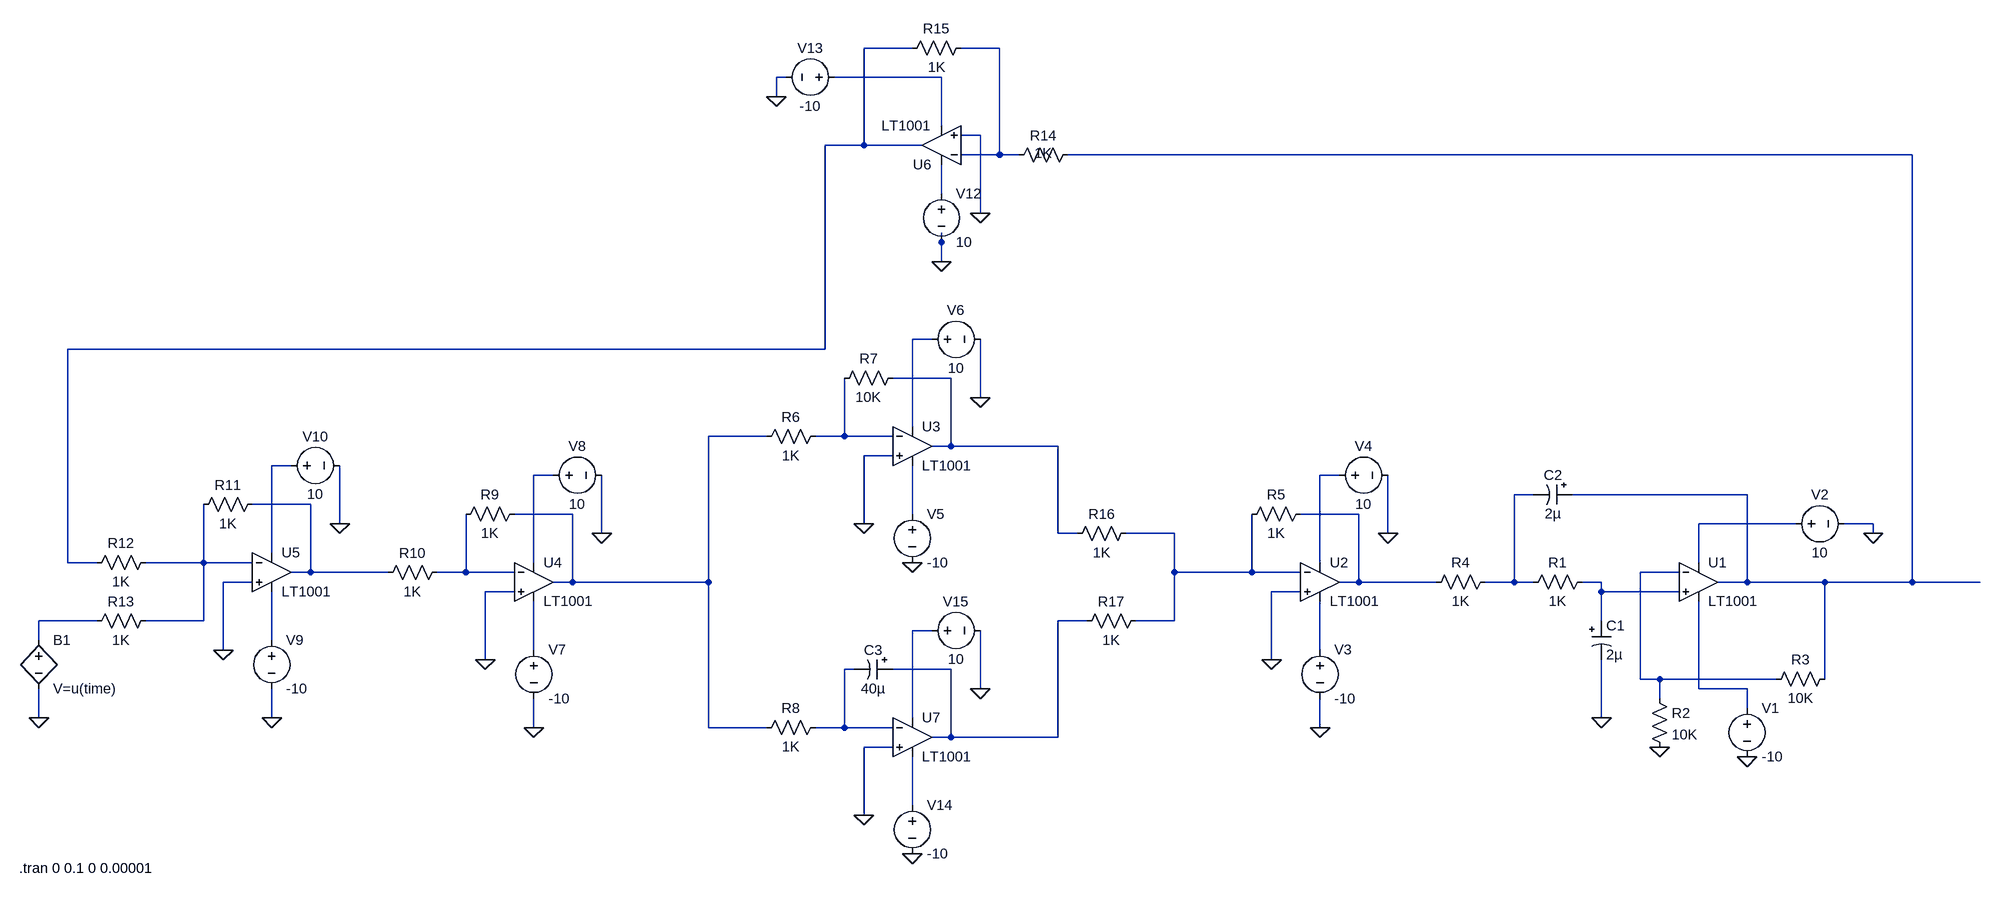
[diagram p0: schematic PI_controller.asc]
PI_controller.asc, the LTspice schematic file:
Version 4
SHEET 1 2324 1300
WIRE 560 -112 480 -112
WIRE 704 -112 640 -112
WIRE 352 -64 336 -64
WIRE 608 -64 432 -64
WIRE 336 -32 336 -64
WIRE 608 16 608 -64
WIRE 672 32 640 32
WIRE 480 48 480 -112
WIRE 480 48 416 48
WIRE 576 48 480 48
WIRE 704 64 704 -112
WIRE 704 64 640 64
WIRE 736 64 704 64
WIRE 2208 64 816 64
WIRE 608 128 608 80
WIRE 672 160 672 32
WIRE 608 208 608 192
WIRE 608 240 608 208
WIRE 592 368 560 368
WIRE 416 384 416 48
WIRE 416 384 -832 384
WIRE 624 432 528 432
WIRE 672 464 672 368
WIRE 560 512 560 368
WIRE 320 528 224 528
WIRE 448 528 448 432
WIRE 448 528 400 528
WIRE 528 528 448 528
WIRE 624 544 624 432
WIRE 624 544 592 544
WIRE 800 544 624 544
WIRE 528 560 480 560
WIRE -464 576 -496 576
WIRE -32 592 -64 592
WIRE 1264 592 1232 592
WIRE 1584 624 1552 624
WIRE 1936 624 1648 624
WIRE -432 640 -528 640
WIRE 0 656 -96 656
WIRE 560 656 560 576
WIRE 1296 656 1200 656
WIRE -384 672 -384 576
WIRE 480 672 480 560
WIRE 2016 672 1856 672
WIRE 2144 672 2096 672
WIRE 48 688 48 592
WIRE 800 688 800 544
WIRE 832 688 800 688
WIRE 992 688 912 688
WIRE 1344 688 1344 592
WIRE 2144 688 2144 672
WIRE -496 720 -496 576
WIRE -832 736 -832 384
WIRE -784 736 -832 736
WIRE -608 736 -608 640
WIRE -608 736 -704 736
WIRE -528 736 -608 736
WIRE -64 736 -64 592
WIRE 1232 736 1232 592
WIRE 1856 736 1856 672
WIRE -432 752 -432 640
WIRE -432 752 -464 752
WIRE -304 752 -432 752
WIRE -176 752 -176 656
WIRE -176 752 -224 752
WIRE -96 752 -176 752
WIRE 992 752 992 688
WIRE 1120 752 1120 656
WIRE 1120 752 992 752
WIRE 1200 752 1120 752
WIRE 1824 752 1760 752
WIRE -528 768 -576 768
WIRE 0 768 0 656
WIRE 0 768 -32 768
WIRE 224 768 224 528
WIRE 224 768 0 768
WIRE 1296 768 1296 656
WIRE 1296 768 1264 768
WIRE 1424 768 1296 768
WIRE 1552 768 1552 624
WIRE 1552 768 1504 768
WIRE 1584 768 1552 768
WIRE 1696 768 1664 768
WIRE 1936 768 1936 624
WIRE 1936 768 1888 768
WIRE 2064 768 1936 768
WIRE 2208 768 2208 64
WIRE 2208 768 2064 768
WIRE 2320 768 2208 768
WIRE -96 784 -144 784
WIRE 1200 784 1152 784
WIRE 1696 784 1696 768
WIRE 1824 784 1696 784
WIRE -784 832 -880 832
WIRE -608 832 -608 736
WIRE -608 832 -704 832
WIRE 848 832 800 832
WIRE 992 832 992 752
WIRE 992 832 928 832
WIRE 1696 832 1696 784
WIRE 592 848 560 848
WIRE -880 864 -880 832
WIRE -496 864 -496 784
WIRE -576 880 -576 768
WIRE -64 880 -64 800
WIRE 1232 880 1232 800
WIRE -144 896 -144 784
WIRE 1152 896 1152 784
WIRE 464 912 448 912
WIRE 624 912 528 912
WIRE 1760 928 1760 752
WIRE 1792 928 1760 928
WIRE 1984 928 1792 928
WIRE 2064 928 2064 768
WIRE 672 944 672 848
WIRE 1856 944 1856 800
WIRE 1936 944 1856 944
WIRE 1792 960 1792 928
WIRE 1936 976 1936 944
WIRE -880 992 -880 944
WIRE -496 992 -496 944
WIRE 560 992 560 848
WIRE 1696 992 1696 896
WIRE -64 1008 -64 960
WIRE 224 1008 224 768
WIRE 320 1008 224 1008
WIRE 448 1008 448 912
WIRE 448 1008 400 1008
WIRE 528 1008 448 1008
WIRE 1232 1008 1232 960
WIRE 624 1024 624 912
WIRE 624 1024 592 1024
WIRE 800 1024 800 832
WIRE 800 1024 624 1024
WIRE 528 1040 480 1040
WIRE 560 1136 560 1056
WIRE 480 1152 480 1040
FLAG 1792 1040 0
FLAG 1696 992 0
FLAG 1936 1056 0
FLAG 2144 688 0
FLAG 1344 688 0
FLAG 1232 1008 0
FLAG 1152 896 0
FLAG 672 464 0
FLAG 560 736 0
FLAG 480 672 0
FLAG 48 688 0
FLAG -64 1008 0
FLAG -144 896 0
FLAG -384 672 0
FLAG -496 992 0
FLAG -576 880 0
FLAG -880 992 0
FLAG 608 240 0
FLAG 336 -32 0
FLAG 672 944 0
FLAG 560 1216 0
FLAG 480 1152 0
FLAG 672 160 0
SYMBOL voltage 1936 960 R0
WINDOW 123 0 0 Left 0
WINDOW 39 0 0 Left 0
SYMATTR InstName V1
SYMATTR Value -10
SYMBOL voltage 2000 672 R270
WINDOW 0 32 56 VTop 2
WINDOW 3 -32 56 VBottom 2
WINDOW 123 0 0 Left 0
WINDOW 39 0 0 Left 0
SYMATTR InstName V2
SYMATTR Value 10
SYMBOL res 1680 752 R90
WINDOW 0 0 56 VBottom 2
WINDOW 3 32 56 VTop 2
SYMATTR InstName R1
SYMATTR Value 1K
SYMBOL polcap 1680 832 R0
SYMATTR InstName C1
SYMATTR Value 2µ
SYMBOL polcap 1648 608 R90
WINDOW 0 0 32 VBottom 2
WINDOW 3 32 32 VTop 2
SYMATTR InstName C2
SYMATTR Value 2µ
SYMBOL OpAmps\\LT1001 1856 704 R0
SYMATTR InstName U1
SYMBOL res 1776 944 R0
SYMATTR InstName R2
SYMATTR Value 10K
SYMBOL res 2080 912 R90
WINDOW 0 0 56 VBottom 2
WINDOW 3 32 56 VTop 2
SYMATTR InstName R3
SYMATTR Value 10K
SYMBOL OpAmps\\LT1001 1232 704 R0
SYMATTR InstName U2
SYMBOL voltage 1232 864 R0
WINDOW 123 0 0 Left 0
WINDOW 39 0 0 Left 0
SYMATTR InstName V3
SYMATTR Value -10
SYMBOL voltage 1248 592 R270
WINDOW 0 32 56 VTop 2
WINDOW 3 -32 56 VBottom 2
WINDOW 123 0 0 Left 0
WINDOW 39 0 0 Left 0
SYMATTR InstName V4
SYMATTR Value 10
SYMBOL res 1520 752 R90
WINDOW 0 0 56 VBottom 2
WINDOW 3 32 56 VTop 2
SYMATTR InstName R4
SYMATTR Value 1K
SYMBOL res 1216 640 R90
WINDOW 0 0 56 VBottom 2
WINDOW 3 32 56 VTop 2
SYMATTR InstName R5
SYMATTR Value 1K
SYMBOL OpAmps\\LT1001 560 480 R0
SYMATTR InstName U3
SYMBOL voltage 560 640 R0
WINDOW 123 0 0 Left 0
WINDOW 39 0 0 Left 0
SYMATTR InstName V5
SYMATTR Value -10
SYMBOL voltage 576 368 R270
WINDOW 0 32 56 VTop 2
WINDOW 3 -32 56 VBottom 2
WINDOW 123 0 0 Left 0
WINDOW 39 0 0 Left 0
SYMATTR InstName V6
SYMATTR Value 10
SYMBOL res 416 512 R90
WINDOW 0 0 56 VBottom 2
WINDOW 3 32 56 VTop 2
SYMATTR InstName R6
SYMATTR Value 1K
SYMBOL res 544 416 R90
WINDOW 0 0 56 VBottom 2
WINDOW 3 32 56 VTop 2
SYMATTR InstName R7
SYMATTR Value 10K
SYMBOL OpAmps\\LT1001 -64 704 R0
SYMATTR InstName U4
SYMBOL voltage -64 864 R0
WINDOW 123 0 0 Left 0
WINDOW 39 0 0 Left 0
SYMATTR InstName V7
SYMATTR Value -10
SYMBOL voltage -48 592 R270
WINDOW 0 32 56 VTop 2
WINDOW 3 -32 56 VBottom 2
WINDOW 123 0 0 Left 0
WINDOW 39 0 0 Left 0
SYMATTR InstName V8
SYMATTR Value 10
SYMBOL res 416 992 R90
WINDOW 0 0 56 VBottom 2
WINDOW 3 32 56 VTop 2
SYMATTR InstName R8
SYMATTR Value 1K
SYMBOL res -80 640 R90
WINDOW 0 0 56 VBottom 2
WINDOW 3 32 56 VTop 2
SYMATTR InstName R9
SYMATTR Value 1K
SYMBOL OpAmps\\LT1001 -496 688 R0
SYMATTR InstName U5
SYMBOL voltage -496 848 R0
WINDOW 123 0 0 Left 0
WINDOW 39 0 0 Left 0
SYMATTR InstName V9
SYMATTR Value -10
SYMBOL voltage -480 576 R270
WINDOW 0 32 56 VTop 2
WINDOW 3 -32 56 VBottom 2
WINDOW 123 0 0 Left 0
WINDOW 39 0 0 Left 0
SYMATTR InstName V10
SYMATTR Value 10
SYMBOL res -208 736 R90
WINDOW 0 0 56 VBottom 2
WINDOW 3 32 56 VTop 2
SYMATTR InstName R10
SYMATTR Value 1K
SYMBOL res -512 624 R90
WINDOW 0 0 56 VBottom 2
WINDOW 3 32 56 VTop 2
SYMATTR InstName R11
SYMATTR Value 1K
SYMBOL res -688 720 R90
WINDOW 0 0 56 VBottom 2
WINDOW 3 32 56 VTop 2
SYMATTR InstName R12
SYMATTR Value 1K
SYMBOL res -688 816 R90
WINDOW 0 0 56 VBottom 2
WINDOW 3 32 56 VTop 2
SYMATTR InstName R13
SYMATTR Value 1K
SYMBOL OpAmps\\LT1001 608 112 R180
SYMATTR InstName U6
SYMBOL res 832 48 R90
WINDOW 0 0 56 VBottom 2
WINDOW 3 -2 56 VTop 2
SYMATTR InstName R14
SYMATTR Value 1K
SYMBOL res 656 -128 R90
WINDOW 0 0 56 VBottom 2
WINDOW 3 32 56 VTop 2
SYMATTR InstName R15
SYMATTR Value 1K
SYMBOL voltage 608 112 R0
WINDOW 123 0 0 Left 0
WINDOW 39 0 0 Left 0
SYMATTR InstName V12
SYMATTR Value 10
SYMBOL voltage 448 -64 R90
WINDOW 0 -32 56 VBottom 2
WINDOW 3 32 56 VTop 2
WINDOW 123 0 0 Left 0
WINDOW 39 0 0 Left 0
SYMATTR InstName V13
SYMATTR Value -10
SYMBOL OpAmps\\LT1001 560 960 R0
SYMATTR InstName U7
SYMBOL voltage 560 1120 R0
WINDOW 123 0 0 Left 0
WINDOW 39 0 0 Left 0
SYMATTR InstName V14
SYMATTR Value -10
SYMBOL voltage 576 848 R270
WINDOW 0 32 56 VTop 2
WINDOW 3 -32 56 VBottom 2
WINDOW 123 0 0 Left 0
WINDOW 39 0 0 Left 0
SYMATTR InstName V15
SYMATTR Value 10
SYMBOL polcap 528 896 R90
WINDOW 0 0 32 VBottom 2
WINDOW 3 32 32 VTop 2
SYMATTR InstName C3
SYMATTR Value 40µ
SYMBOL res 928 672 R90
WINDOW 0 0 56 VBottom 2
WINDOW 3 32 56 VTop 2
SYMATTR InstName R16
SYMATTR Value 1K
SYMBOL res 944 816 R90
WINDOW 0 0 56 VBottom 2
WINDOW 3 32 56 VTop 2
SYMATTR InstName R17
SYMATTR Value 1K
SYMBOL bv -880 848 R0
SYMATTR InstName B1
SYMATTR Value V=u(time)
TEXT -912 1240 Left 2 !.tran 0 0.1 0 0.00001

The netlist it stands for:
* PI_controller.asc
V1 N030 0 -10
V2 N017 0 10
R1 N022 N013 1K
C1 N022 0 2µ
C2 N004 N013 2µ
XU1 N022 N021 N017 N030 N004 LT1001  ; pins In+ In- V+ V- OUT
R2 N021 0 10K
R3 N004 N021 10K
XU2 0 N018 N012 N028 N016 LT1001  ; pins In+ In- V+ V- OUT
V3 N028 0 -10
V4 N012 0 10
R4 N013 N016 1K
R5 N016 N018 1K
XU3 0 N009 N006 N015 N007 LT1001  ; pins In+ In- V+ V- OUT
V5 N015 0 -10
V6 N006 0 10
R6 N009 N008 1K
R7 N007 N009 10K
XU4 0 N020 N011 N027 N008 LT1001  ; pins In+ In- V+ V- OUT
V7 N027 0 -10
V8 N011 0 10
R8 N029 N008 1K
R9 N008 N020 1K
XU5 0 N019 N010 N026 N014 LT1001  ; pins In+ In- V+ V- OUT
V9 N026 0 -10
V10 N010 0 10
R10 N020 N014 1K
R11 N014 N019 1K
R12 N019 N001 1K
R13 N019 N023 1K
XU6 0 N002 N005 N003 N001 LT1001  ; pins In+ In- V+ V- OUT
R14 N004 N002 1K
R15 N002 N001 1K
V12 N005 0 10
V13 N003 0 -10
XU7 0 N029 N025 N031 N024 LT1001  ; pins In+ In- V+ V- OUT
V14 N031 0 -10
V15 N025 0 10
C3 N024 N029 40µ
R16 N018 N007 1K
R17 N018 N024 1K
B1 N023 0 V=u(time)
.tran 0 0.1 0 0.00001
.lib LTC.lib
.backanno
.end